# Altium schematic sheet mcu.SchDoc
size A4; SheetNumber: 8; SheetTotal: 8
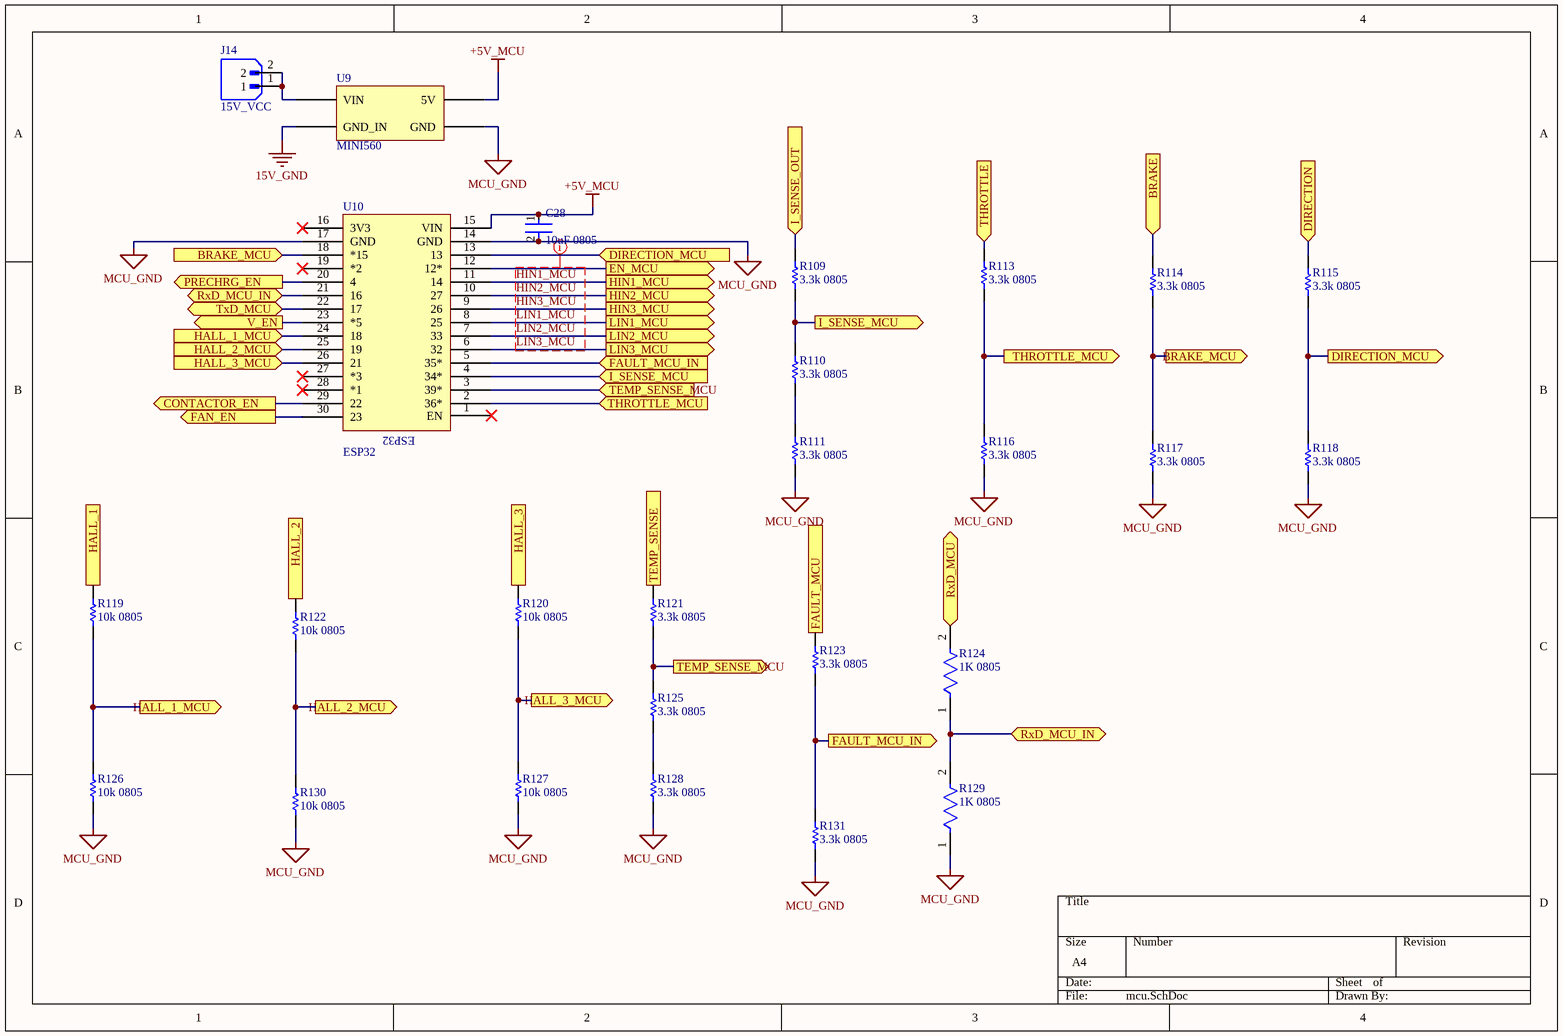
[diagram p0: mcu.SchDoc]

## Parts
C28  10uF 0805  [R0805]
J14  15V_VCC  [XH2.5-2p]
R109  3.3k 0805  [R0805]
R110  3.3k 0805  [R0805]
R111  3.3k 0805  [R0805]
R113  3.3k 0805  [R0805]
R114  3.3k 0805  [R0805]
R115  3.3k 0805  [R0805]
R116  3.3k 0805  [R0805]
R117  3.3k 0805  [R0805]
R118  3.3k 0805  [R0805]
R119  10k 0805  [R0805]
R120  10k 0805  [R0805]
R121  3.3k 0805  [R0805]
R122  10k 0805  [R0805]
R123  3.3k 0805  [R0805]
R124  1K 0805  [R0805]
R125  3.3k 0805  [R0805]
R126  10k 0805  [R0805]
R127  10k 0805  [R0805]
R128  3.3k 0805  [R0805]
R129  1K 0805  [R0805]
R130  10k 0805  [R0805]
R131  3.3k 0805  [R0805]
U9  MINI560  [MINI560]
U10  ESP32  [esp32]

## Ports
BRAKE (in), BRAKE_MCU (in), BRAKE_MCU (out), CONTACTOR_EN (out), DIRECTION (in), DIRECTION_MCU (in), DIRECTION_MCU (out), EN_MCU (out), FAN_EN (out), FAULT_MCU (in), FAULT_MCU_IN (in), FAULT_MCU_IN (out), HALL_1 (in), HALL_1_MCU (in), HALL_1_MCU (out), HALL_2 (in), HALL_2_MCU (in), HALL_2_MCU (out), HALL_3 (in), HALL_3_MCU (in), HALL_3_MCU (out), HIN1_MCU (out), HIN2_MCU (out), HIN3_MCU (out), I_SENSE_MCU (in), I_SENSE_MCU (out), I_SENSE_OUT (in), LIN1_MCU (out), LIN2_MCU (out), LIN3_MCU (out), PRECHRG_EN (out), RxD_MCU (bidir), RxD_MCU_IN (bidir), TEMP_SENSE (in), TEMP_SENSE_MCU (in), TEMP_SENSE_MCU (out), THROTTLE (in), THROTTLE_MCU (in), THROTTLE_MCU (out), TxD_MCU (bidir), V_EN (out)

## Nets
15V_GND: U9.2(GND_IN)
+5V_MCU: C28.1 U9.3(5V) U10.15(VIN)
MCU_GND: C28.2 R111.1 R116.1 R117.1 R118.1 R126.1 R127.1 R128.1 R129.1 R130.1 R131.1 U9.4(GND) U10.14(GND) U10.17(GND)
BRAKE: R114.2 ; port BRAKE
BRAKE_MCU: R114.1 R117.2 U10.18(*15) ; port BRAKE_MCU
CONTACTOR_EN: U10.29(22) ; port CONTACTOR_EN
DIRECTION: R115.2 ; port DIRECTION
DIRECTION_MCU: R115.1 R118.2 U10.13 ; port DIRECTION_MCU
EN_MCU: U10.12(12*) ; port EN_MCU
FAN_EN: U10.30(23) ; port FAN_EN
FAULT_MCU: R123.2 ; port FAULT_MCU
FAULT_MCU_IN: R123.1 R131.2 U10.5(35*) ; port FAULT_MCU_IN
HALL_1: R119.2 ; port HALL_1
HALL_1_MCU: R119.1 R126.2 U10.24(18) ; port HALL_1_MCU
HALL_2: R122.2 ; port HALL_2
HALL_2_MCU: R122.1 R130.2 U10.25(19) ; port HALL_2_MCU
HALL_3: R120.2 ; port HALL_3
HALL_3_MCU: R120.1 R127.2 U10.26(21) ; port HALL_3_MCU
HIN1_MCU: U10.11(14) ; port HIN1_MCU
HIN2_MCU: U10.10(27) ; port HIN2_MCU
HIN3_MCU: U10.9(26) ; port HIN3_MCU
I_SENSE_MCU: R109.1 R110.2 U10.4(34*) ; port I_SENSE_MCU
I_SENSE_OUT: R109.2 ; port I_SENSE_OUT
LIN1_MCU: U10.8(25) ; port LIN1_MCU
LIN2_MCU: U10.7(33) ; port LIN2_MCU
LIN3_MCU: U10.6(32) ; port LIN3_MCU
PRECHRG_EN: U10.20(4) ; port PRECHRG_EN
RxD_MCU: R124.2 ; port RxD_MCU
RxD_MCU_IN: R124.1 R129.2 U10.21(16) ; port RxD_MCU_IN
TEMP_SENSE: R121.2 ; port TEMP_SENSE
TEMP_SENSE_MCU: R121.1 R125.2 U10.3(39*) ; port TEMP_SENSE_MCU
THROTTLE: R113.2 ; port THROTTLE
THROTTLE_MCU: R113.1 R116.2 U10.2(36*) ; port THROTTLE_MCU
TxD_MCU: U10.22(17) ; port TxD_MCU
V_EN: U10.23(*5) ; port V_EN
NetJ14_1: J14.1 J14.2 U9.1(VIN)
NetR110_1: R110.1 R111.2
NetR125_1: R125.1 R128.2

Not connected (* = marked no-connect by the designer): U10 1(EN)* 16(3V3)* 19(*2)* 27(*3)* 28(*1)*

## Layout directives
rule Matched Net Lengths [Tolerance = 1mm]; net class PWM: HIN1_MCU, HIN2_MCU, HIN3_MCU, LIN1_MCU, LIN2_MCU, LIN3_MCU

## Library data of the parts
C28 = 10uF 0805: 10uF/1000nF 50V Capacitor ±10% Tolerance CC0805KKX5R9BB106 – 0805 Package; Product URL: https://sharvielectronics.com/product/10uf-1000nf-50v-capacitor-%c2%b110-tolerance-cc0805kkx5r9bb106-0805-package/; Price per piece: 2.85; Datasheet: https://drive.google.com/file/d/1wr2K_YaGqgMtACeU2pC6RWLSxDMrIPxr/view?usp=sharing
J14 = XH2.5-2p: 2 Pin JST-XH Male Straight 2515 Connector 2.54mm Pitch; Price per piece: 1.65; Product URL: https://sharvielectronics.com/product/2-pin-jst-xh-male-straight-2515-connector-2-54mm-pitch/; Datasheet: https://sharvielectronics.com/wp-content/uploads/2021/01/XH-Connector.pdf
R109-R111 R113-R118 R121 R123 R125 R128 R131 = R0805: 3.3K Ohm 1/8 Watt Resistor 1% Tolerance RC0805FR-073K3L – 0805 Package; Price per piece: 0.82; Product URL: https://sharvielectronics.com/product/3-3k-ohm-1-8-watt-resistor-1-tolerance-rc0805fr-073k3l-0805-package/; Datasheet: https://drive.google.com/file/d/1pkLQT_RQ1i35oFQcGREpZr7Oy3Ppi-ZT/view?usp=sharing
R119 R120 R122 R126 R127 R130 = 10k 0805: 10K Ohm 1/8 Watt Resistor 1% Tolerance RC0805FR-0710KL – 0805 Package; Price per piece: 0.82; Product URL: https://sharvielectronics.com/product/10k-ohm-1-8-watt-resistor-1-tolerance-rc0805fr-0710kl-0805-package/; Datasheet: https://drive.google.com/file/d/1pkLQT_RQ1i35oFQcGREpZr7Oy3Ppi-ZT/view?usp=sharing
R124 R129 = 1k 0805: 1K Ohm 1/8 Watt Resistor 1% Tolerance 0805S8F1001T5E – 0805 Package; Price per piece: 0.82; Product URL: https://sharvielectronics.com/product/1k-ohm-1-8-watt-resistor-1-tolerance-0805s8f1001t5e-0805-package/; Datasheet: https://drive.google.com/file/d/1rtx85iFJaMrDbsv7PAzG9bTFItPmAE38/view?usp=sharing
U9 = MINI560: MINI560 5VDC 5A Step-Down Stabilized Module; Price per piece: 125.33; Product URL: https://sharvielectronics.com/product/mini560-5vdc-5a-step-down-stabilized-module/